# Altium schematic sheet Atom.SchDoc
size A2
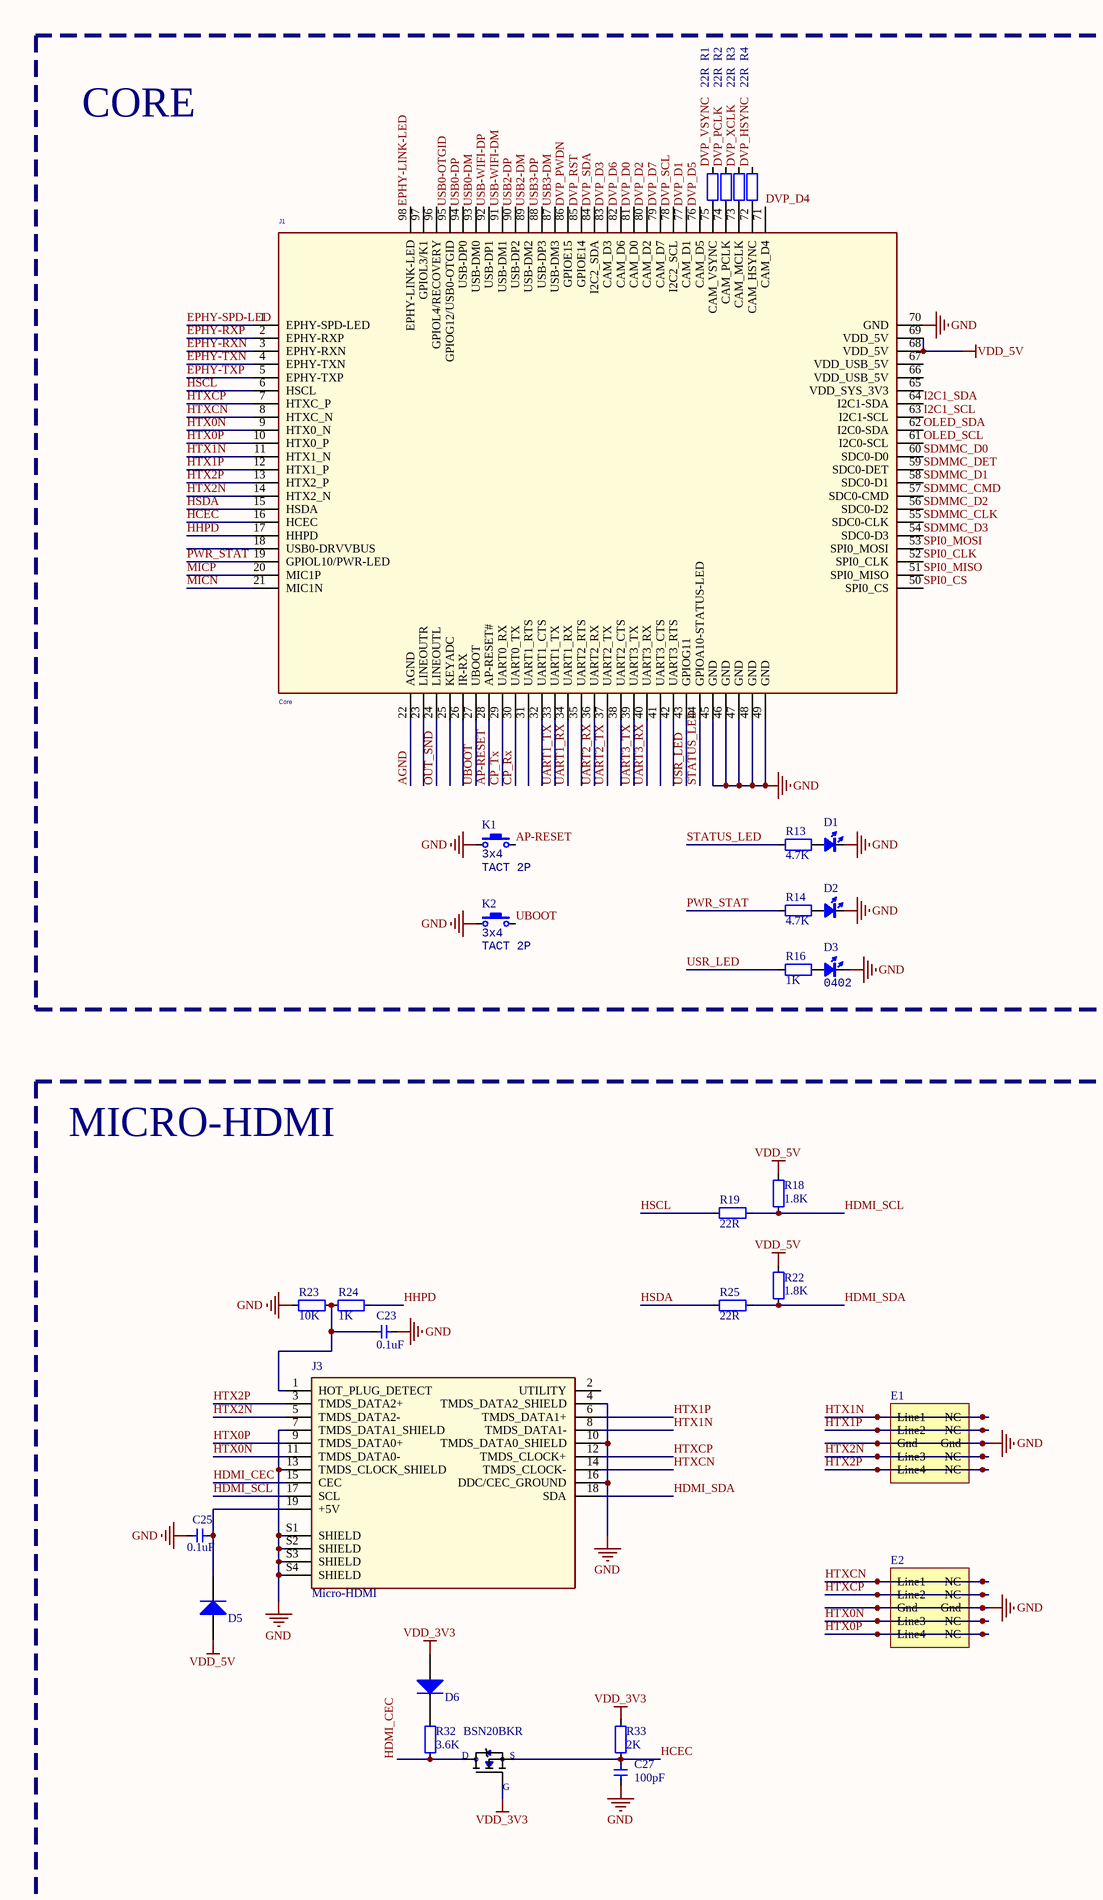
[diagram p0: Atom.SchDoc, left]
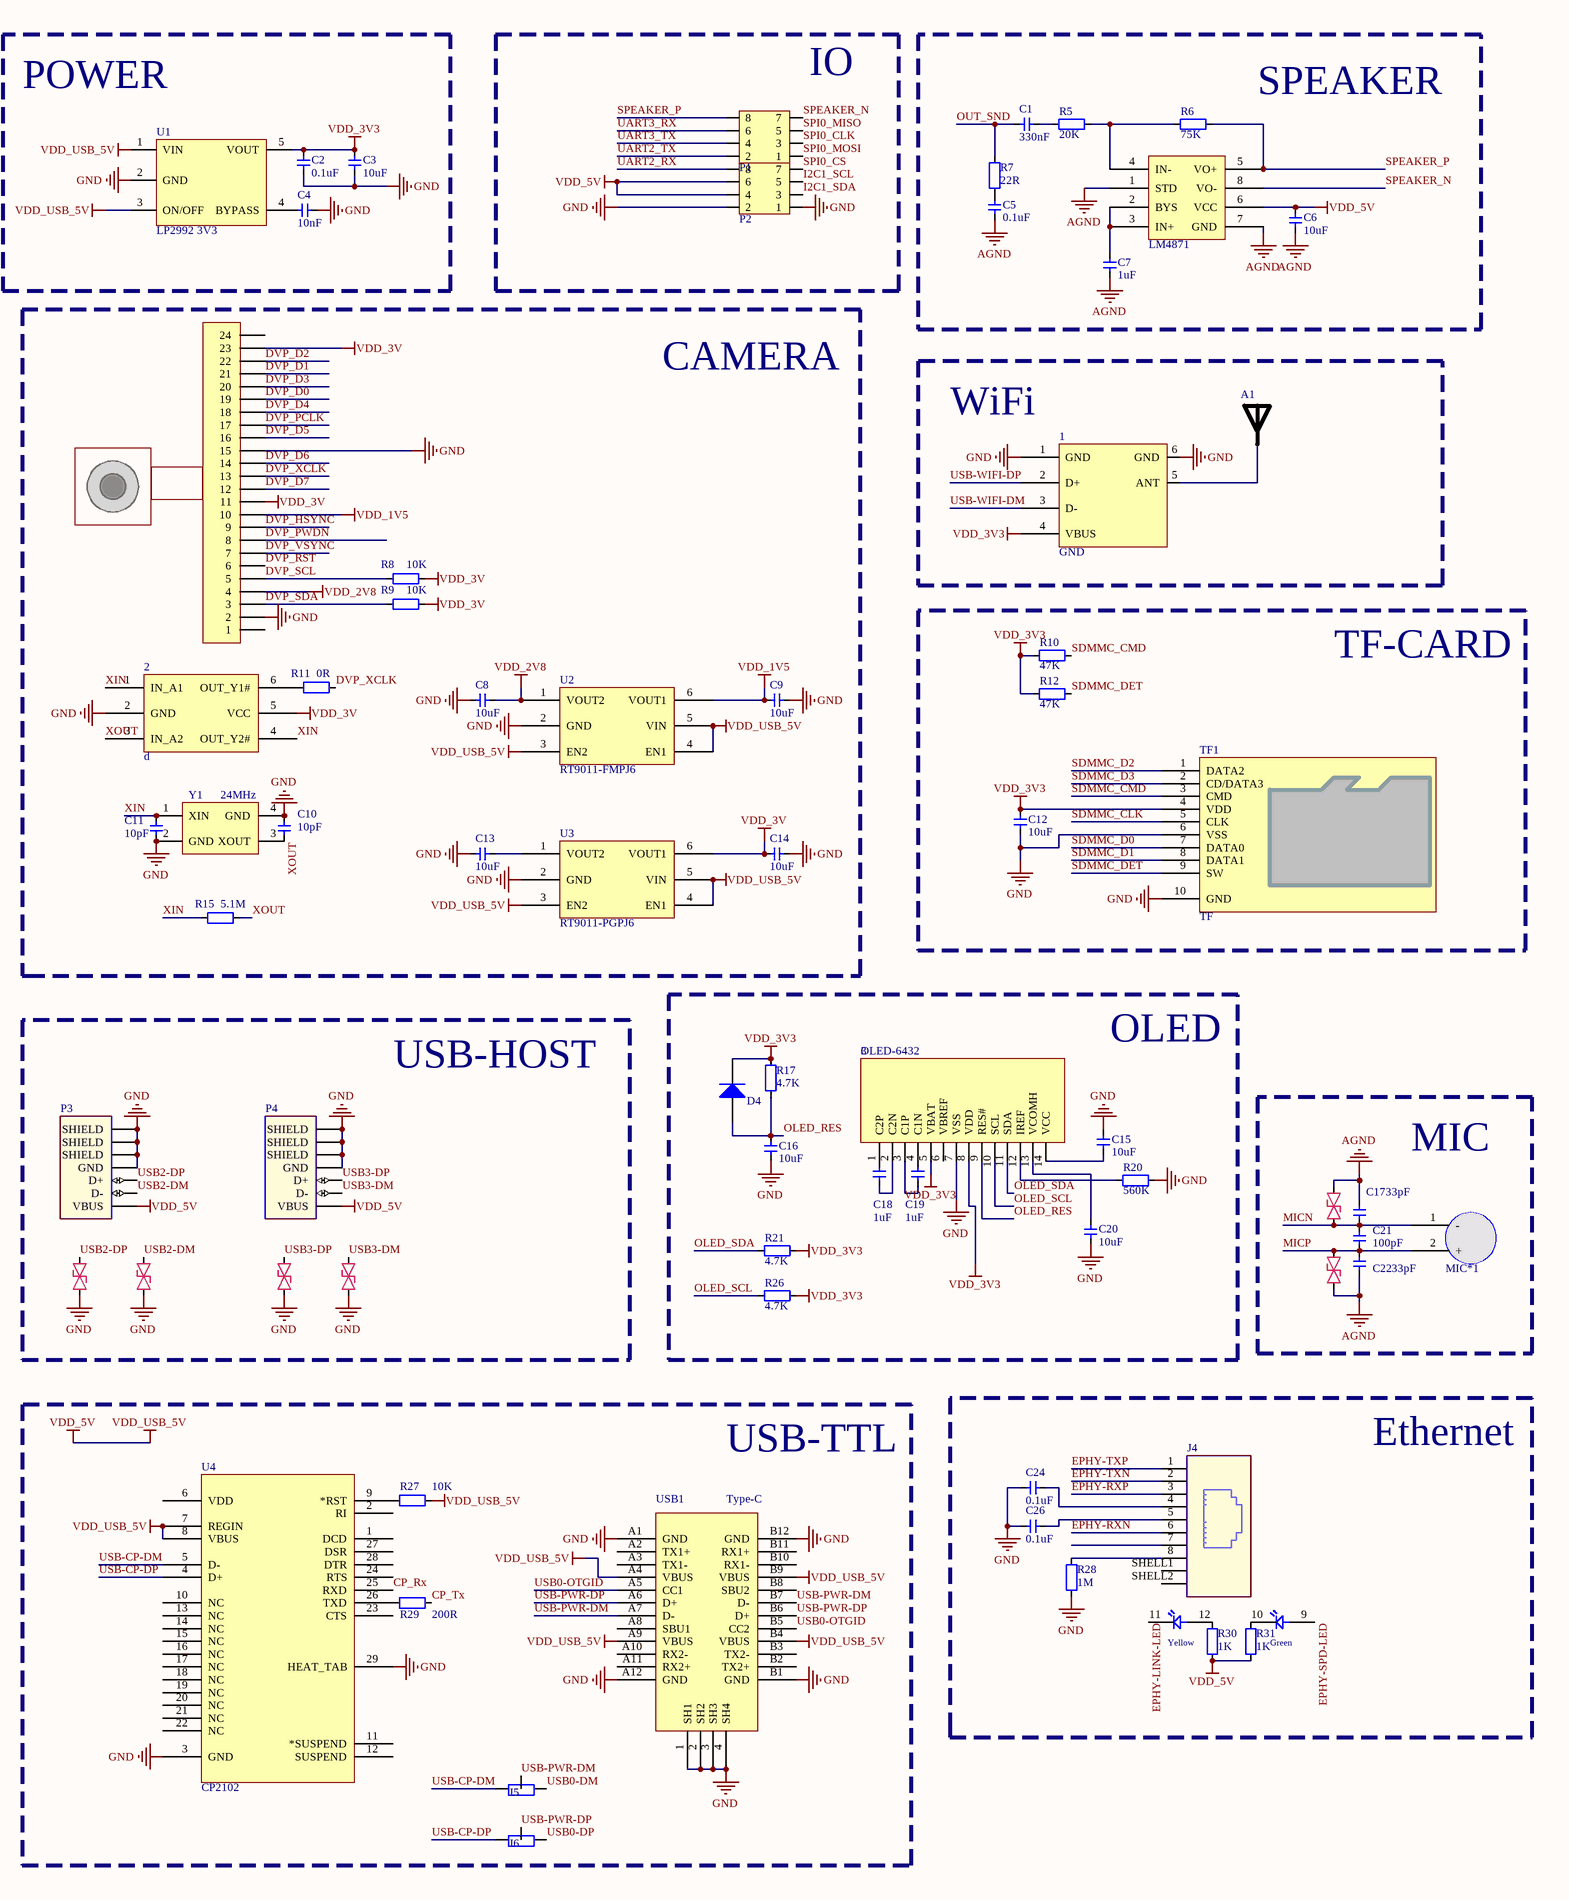
[diagram p1: Atom.SchDoc, right]

## Parts
1  GND  [USB-WiFI-ANT]
2  d  [SOT363-6]
3  OLED-6432  [OLED-6432-TOP]
4  BSN20BKR  [SOT23-3]
*1  LM4871  [MSOP-8]
A1  RAINSUN  [ANT-Rainsun-AN5120]  (value not drawn)
C1  330nF  [0603-CAP]
C2  0.1uF  [CAP_0402]
C3  10uF  [CAP_0402]
C4  10nF  [CAP_0402]
C5  0.1uF  [CAP_0402]
C6  10uF  [CAP_0402]
C7  1uF  [CAP_0402]
C8  10uF  [CAP_0402]
C9  10uF  [CAP_0402]
C10  10pF  [CAP_0402]
C11  10pF  [CAP_0402]
C12  10uF  [CAP_0402]
C13  10uF  [CAP_0402]
C14  10uF  [CAP_0402]
C15  10uF  [CAP_0402]
C16  10uF  [CAP_0402]
C17  33pF  [CAP_0402]
C18  1uF  [CAP_0402]
C19  1uF  [CAP_0402]
C20  10uF  [CAP_0402]
C21  100pF  [CAP_0402]
C22  33pF  [CAP_0402]
C23  0.1uF  [CAP_0402]
C24  0.1uF  [CAP_0402]
C25  0.1uF  [CAP_0402]
C26  0.1uF  [CAP_0402]
C27  100pF  [CAP_0402]
D1  color?  [LED_0402_RED]  (value not drawn)
D2  color?  [LED_0402_RED]  (value not drawn)
D3  Type: 0402  [LED_0402_RED]  (hidden comment: color?)
D4  二极管-5B5817WS  [SOD-323]  (value not drawn)
D5  二极管-5B5817WS  [SOD-323]  (value not drawn)
D6  二极管-5B5817WS  [SOD-323]  (value not drawn)
E1  E?  [DFN-2510]  (value not drawn)
E2  E?  [DFN-2510]  (value not drawn)
ESD-1  ESD-0402  [ESD-0402]  (value not drawn)
ESD-2  ESD-0402  [ESD-0402]  (value not drawn)
ESD-3  ESD-0402  [ESD-0402]  (value not drawn)
ESD-4  ESD-0402  [ESD-0402]  (value not drawn)
ESD-5  ESD-0402  [ESD-0402]  (value not drawn)
ESD-6  ESD-0402  [ESD-0402]  (value not drawn)
J1  Core  [Quantum-Quark]
J2  0.5S_A_24PWB  [FPC-24P]  (value not drawn)
J3  Micro-HDMI  [MICRO HDMI]
J4  RJ45座  [RJ45母座]  (value not drawn)
J5  选择跳线  [jumper-3]  (value not drawn)
J6  选择跳线  [jumper-3]  (value not drawn)
K1  value 3x4  [ButtonTACT_3x4x2_180]  (hidden comment: TACT 2P)
K2  value 3x4  [ButtonTACT_3x4x2_180]  (hidden comment: TACT 2P)
MIC*1  MIC*  [MIC-0416]  (value not drawn)
P1  HDR2x4_2.54  [HDR2X4_2.0_180H]  (value not drawn)
P2  HDR2x4_2.54  [HDR2X4_2.0_180H]  (value not drawn)
P3  USB-侧立式  [USB-侧立式]  (value not drawn)
P4  USB-侧立式  [USB-侧立式]  (value not drawn)
R1  22R  [RES_0402]
R2  22R  [RES_0402]
R3  22R  [RES_0402]
R4  22R  [RES_0402]
R5  20K  [RES_0402]
R6  75K  [RES_0402]
R7  22R  [RES_0402]
R8  10K  [RES_0402]
R9  10K  [RES_0402]
R10  47K  [RES_0402]
R11  0R  [RES_0402]
R12  47K  [RES_0402]
R13  4.7K  [RES_0402]
R14  4.7K  [RES_0402]
R15  5.1M  [RES_0402]
R16  1K  [RES_0402]
R17  4.7K  [RES_0402]
R18  1.8K  [RES_0402]
R19  22R  [RES_0402]
R20  560K  [RES_0402]
R21  4.7K  [RES_0402]
R22  1.8K  [RES_0402]
R23  10K  [RES_0402]
R24  1K  [RES_0402]
R25  22R  [RES_0402]
R26  4.7K  [RES_0402]
R27  10K  [RES_0402]
R28  1M  [RES_0402]
R29  200R  [RES_0402]
R30  1K  [RES_0402]
R31  1K  [RES_0402]
R32  3.6K  [RES_0402]
R33  2K  [RES_0402]
TF1  TF  [TF-SOCKET - short]
U1  LP2992 3V3  [SOT23-5]
U2  RT9011-FMPJ6  [SOT23-6]
U3  RT9011-PGPJ6  [SOT23-6]
U4  CP2102  [QFN-28]
USB1  Type-C  [Type-C-TOP]
Y1  24MHz  [晶振2520]

## Blocks framed on the sheet
POWER: C2-C4 U1
IO: P1 P2
SPEAKER: *1 C1 C5-C7 R5-R7
TF-CARD: C12 R10 R12 TF1
USB-HOST: ESD-3-ESD-6 P3 P4

## Nets
AGND: *1.1(STD) *1.7(GND) C5.1 C6.1 C7.1 C17.1 C22.1 ESD-1.2 ESD-2.1 J1.22(AGND)
GND: 1.1(GND) 1.6(GND) 2.2(GND) 3.7(VSS) C2.1 C3.1 C4.1 C8.1 C9.1 C10.2 C11.1 C12.1 C13.1 C14.1 C15.1 C16.1 C20.2 C23.1 C24.2 C25.2 C26.2 C27.1 D1.2(K) D2.2(K) D3.2(K) E1.3(Gnd) E1.8(Gnd) E2.3(Gnd) E2.8(Gnd) ESD-3.1 ESD-4.1 ESD-5.1 ESD-6.1 J1.45(GND) J1.46(GND) J1.47(GND) J1.48(GND) J1.49(GND) J1.70(GND) J2.2 J2.15 J3.4(TMDS_DATA2_SHIELD) J3.7(TMDS_DATA1_SHIELD) J3.10(TMDS_DATA0_SHIELD) J3.13(TMDS_CLOCK_SHIELD) J3.16(DDC/CEC_GROUND) J3.S1(SHIELD) J3.S2(SHIELD) J3.S3(SHIELD) J3.S4(SHIELD) K1.1 K2.1 P2.1 P2.2 P3.4(GND) P3.5(SHIELD) P3.6(SHIELD) P3.7(SHIELD) P4.4(GND) P4.5(SHIELD) P4.6(SHIELD) P4.7(SHIELD) R20.1 R23.1 R28.1 TF1.6(VSS) TF1.10(GND) U1.2(GND) U2.2(GND) U3.2(GND) U4.3(GND) U4.29(HEAT_TAB) USB1.1(SH1) USB1.2(SH2) USB1.3(SH3) USB1.4(SH4) USB1.A1(GND) USB1.A12(GND) USB1.B1(GND) USB1.B12(GND) Y1.2(GND) Y1.4(GND)
VDD_1V5: C9.2 J2.10 U2.6(VOUT1)
VDD_2V8: C8.2 J2.4 U2.1(VOUT2)
VDD_3V: 2.5(VCC) C14.2 J2.11 J2.23 R8.2 R9.2 U3.6(VOUT1)
VDD_3V3: 1.4(VBUS) 3.5(VBAT) 3.8(VDD) 4.1(G) C2.2 C3.2 C12.2 D4.2(K) D6.1(A) R10.1 R12.1 R17.1 R21.2 R26.2 R33.2 TF1.4(VDD) U1.5(VOUT)
VDD_5V: *1.6(VCC) C6.2 D5.1(A) J1.68(VDD_5V) J1.69(VDD_5V) P2.4 P2.6 P3.1(VBUS) P4.1(VBUS) R18.2 R22.2 R27.1 R30.1 R31.1 U1.1(VIN) U1.3(ON/OFF) U2.3(EN2) U2.4(EN1) U2.5(VIN) U3.3(EN2) U3.4(EN1) U3.5(VIN) U4.7(REGIN) U4.8(VBUS) USB1.A4(VBUS) USB1.A9(VBUS) USB1.B4(VBUS) USB1.B9(VBUS)  [also labelled VDD_USB_5V]
AP-RESET: J1.28(AP-RESET#) K1.2
CP_Rx: J1.30(UART0_TX) U4.25(RXD)
CP_Tx: J1.29(UART0_RX) R29.1
DVP_D0: J1.81(CAM_D0) J2.19
DVP_D1: J1.77(CAM_D1) J2.21
DVP_D2: J1.80(CAM_D2) J2.22
DVP_D3: J1.83(CAM_D3) J2.20
DVP_D4: J1.71(CAM_D4) J2.18
DVP_D5: J1.76(CAM_D5) J2.16
DVP_D6: J1.82(CAM_D6) J2.14
DVP_D7: J1.79(CAM_D7) J2.12
DVP_HSYNC: J2.9 R4.1
DVP_PCLK: J2.17 R2.1
DVP_PWDN: J1.86(GPIOE15) J2.8
DVP_RST: J1.85(GPIOE14) J2.6
DVP_SCL: J1.78(I2C2_SCL) J2.5 R8.1
DVP_SDA: J1.84(I2C2_SDA) J2.3 R9.1
DVP_VSYNC: J2.7 R1.1
DVP_XCLK: J2.13 R3.1 R11.2
EPHY-LINK-LED: J1.98(EPHY-LINK-LED) J4.11
EPHY-RXN: J1.3(EPHY-RXN) J4.6
EPHY-RXP: J1.2(EPHY-RXP) J4.3
EPHY-SPD-LED: J1.1(EPHY-SPD-LED) J4.9
EPHY-TXN: J1.4(EPHY-TXN) J4.2
EPHY-TXP: J1.5(EPHY-TXP) J4.1
HCEC: 4.2(S) C27.2 J1.16(HCEC) R33.1
HDMI_CEC: 4.3(D) J3.15(CEC) R32.1
HDMI_SCL: J3.17(SCL) R18.1 R19.2
HDMI_SDA: J3.18(SDA) R22.1 R25.2
HHPD: J1.17(HHPD) R24.2
HSCL: J1.6(HSCL) R19.1
HSDA: J1.15(HSDA) R25.1
HTX0N: E2.4(Line3) E2.7(NC) J1.9(HTX0_N) J3.11(TMDS_DATA0-)
HTX0P: E2.5(Line4) E2.6(NC) J1.10(HTX0_P) J3.9(TMDS_DATA0+)
HTX1N: E1.1(Line1) E1.10(NC) J1.11(HTX1_N) J3.8(TMDS_DATA1-)
HTX1P: E1.2(Line2) E1.9(NC) J1.12(HTX1_P) J3.6(TMDS_DATA1+)
HTX2N: E1.4(Line3) E1.7(NC) J1.14(HTX2_N) J3.5(TMDS_DATA2-)
HTX2P: E1.5(Line4) E1.6(NC) J1.13(HTX2_P) J3.3(TMDS_DATA2+)
HTXCN: E2.1(Line1) E2.10(NC) J1.8(HTXC_N) J3.14(TMDS_CLOCK-)
HTXCP: E2.2(Line2) E2.9(NC) J1.7(HTXC_P) J3.12(TMDS_CLOCK+)
I2C1_SCL: J1.63(I2C1-SCL) P2.5
I2C1_SDA: J1.64(I2C1-SDA) P2.3
MICN: C17.2 C21.2 ESD-1.1 J1.21(MIC1N) MIC*1.1(-)
MICP: C21.1 C22.2 ESD-2.2 J1.20(MIC1P) MIC*1.2(+)
OLED_RES: 3.9(RES#) C16.2 D4.1(A) R17.2
OLED_SCL: 3.10(SCL) J1.61(I2C0-SCL) R26.1
OLED_SDA: 3.11(SDA) J1.62(I2C0-SDA) R21.1
OUT_SND: C1.2 J1.24(LINEOUTL) R7.2
PWR_STAT: J1.19(GPIOL10/PWR-LED) R14.1
SDMMC_CLK: J1.55(SDC0-CLK) TF1.5(CLK)
SDMMC_CMD: J1.57(SDC0-CMD) R10.2 TF1.3(CMD)
SDMMC_D0: J1.60(SDC0-D0) TF1.7(DATA0)
SDMMC_D1: J1.58(SDC0-D1) TF1.8(DATA1)
SDMMC_D2: J1.56(SDC0-D2) TF1.1(DATA2)
SDMMC_D3: J1.54(SDC0-D3) TF1.2(CD/DATA3)
SDMMC_DET: J1.59(SDC0-DET) R12.2 TF1.9(SW)
SPEAKER_N: *1.8(VO-) P1.7
SPEAKER_P: *1.5(VO+) P1.8 R6.2
SPI0_CLK: J1.52(SPI0_CLK) P1.3
SPI0_CS: J1.50(SPI0_CS) P2.7
SPI0_MISO: J1.51(SPI0_MISO) P1.5
SPI0_MOSI: J1.53(SPI0_MOSI) P1.1
STATUS_LED: J1.44(GPIOA10-STATUS-LED) R13.1
UART1_RX: J1.34(UART1_RX)
UART1_TX: J1.33(UART1_TX)
UART2_RX: J1.36(UART2_RX) P2.8
UART2_TX: J1.37(UART2_TX) P1.2
UART3_RX: J1.40(UART3_RX) P1.6
UART3_TX: J1.39(UART3_TX) P1.4
UBOOT: J1.27(UBOOT) K2.2
USB0-DM: J1.93(USB-DM0) J5.3
USB0-DP: J1.94(USB-DP0) J6.3
USB0-OTGID: J1.95(GPIOG12/USB0-OTGID) USB1.A5(CC1) USB1.B5(CC2)
USB2-DM: ESD-4.2 J1.89(USB-DM2) P3.2(D-)
USB2-DP: ESD-3.2 J1.90(USB-DP2) P3.3(D+)
USB3-DM: ESD-6.2 J1.87(USB-DM3) P4.2(D-)
USB3-DP: ESD-5.2 J1.88(USB-DP3) P4.3(D+)
USB-CP-DM: J5.1 U4.5(D-)
USB-CP-DP: J6.1 U4.4(D+)
USB-PWR-DM: J5.2 USB1.A7(D-) USB1.B7(D-)
USB-PWR-DP: J6.2 USB1.A6(D+) USB1.B6(D+)
USB-WIFI-DM: 1.3(D-) J1.91(USB-DM1)
USB-WIFI-DP: 1.2(D+) J1.92(USB-DP1)
USR_LED: J1.43(GPIOG11) R16.1
XIN: 2.1(IN_A1) 2.4(OUT_Y2#) C11.2 R15.1 Y1.1(XIN)
XOUT: 2.3(IN_A2) C10.1 R15.2 Y1.3(XOUT)
Net1_5: 1.5(ANT) A1.1
Net2_6: 2.6(OUT_Y1#) R11.1
Net3_1: 3.1(C2P) C18.2
Net3_2: 3.2(C2N) C18.1
Net3_3: 3.3(C1P) C19.1
Net3_4: 3.4(C1N) C19.2
Net3_12: 3.12(IREF) R20.2
Net3_13: 3.13(VCOMH) C20.1
Net3_14: 3.14(VCC) C15.2
Net*1_2: *1.2(BYS) *1.3(IN+) C7.2
Net*1_4: *1.4(IN-) R5.2 R6.1
NetC1_1: C1.1 R5.1
NetC4_2: C4.2 U1.4(BYPASS)
NetC5_2: C5.2 R7.1
NetC13_2: C13.2 U3.1(VOUT2)
NetC23_2: C23.2 J3.1(HOT_PLUG_DETECT) R23.2 R24.1
NetC24_1: C24.1 J4.4
NetC25_1: C25.1 D5.2(K) J3.19(+5V)
NetC26_1: C26.1 J4.5
NetD1_1: D1.1(A) R13.2
NetD2_1: D2.1(A) R14.2
NetD3_1: D3.1(A) R16.2
NetD6_2: D6.2(K) R32.2
NetJ1_72: J1.72(CAM_HSYNC) R4.2
NetJ1_73: J1.73(CAM_MCLK) R3.2
NetJ1_74: J1.74(CAM_PCLK) R2.2
NetJ1_75: J1.75(CAM_VSYNC) R1.2
NetJ4_8: J4.8 R28.2
NetJ4_10: J4.10 R31.2
NetJ4_12: J4.12 R30.2
NetR27_2: R27.2 U4.9(*RST)
NetR29_2: R29.2 U4.26(TXD)

Not connected (* = marked no-connect by the designer): 3 6(VBREF); J1 18(USB0-DRVVBUS) 23(LINEOUTR) 25(KEYADC) 26(IR-RX) 31(UART1_RTS) 32(UART1_CTS) 35(UART2_RTS) 38(UART2_CTS) 41(UART3_CTS) 42(UART3_RTS) 65(VDD_SYS_3V3) 66(VDD_USB_5V) 67(VDD_USB_5V) 96(GPIOL4/RECOVERY) 97(GPIOL3/K1); J2 1 24; J3 2(UTILITY); J4 7(2) SHELL1(SHIELD) SHELL2(SHIELD); U4 1(DCD) 2(RI) 6(VDD) 10(NC) 11(*SUSPEND) 12(SUSPEND) 13(NC) 14(NC) 15(NC) 16(NC) 17(NC) 18(NC) 19(NC) 20(NC) 21(NC) 22(NC) 23(CTS) 24(RTS) 27(DSR) 28(DTR); USB1 A2(TX1+) A3(TX1-) A8(SBU1) A10(RX2-) A11(RX2+) B2(TX2+) B3(TX2-) B8(SBU2) B10(RX1-) B11(RX1+)

## Notes on the sheet
- CORE
- CAMERA
- (near 1) WiFi
- OLED
- MICRO-HDMI
- MIC
- USB-TTL
- Ethernet
- (in symbol RJ45座) Yellow; Green

## Library data of the parts
1 = USB-WiFi-ANT
2 = NL27WZU04DF
3 = OLED-6432: 显示屏
4 = BSN20BKR: N-Channel 60 V 2.8 Ohm 310 mW 0.49 nC Surface Mount Trench MosFet - SOT-23; MF: Nexperia USA; Price: None; SnapEDA_Link: https://www.snapeda.com/parts/BSN20BKR/Nexperia%20USA%20Inc./view-part/?ref=snap; Availability: Unavailable; MP: BSN20BKR; Package: SOT-23 Nexperia; Value: *
A1 = ANT-Rainsun-AP5120
C1 = 电容-0603: Capacitor; Value: 0.1u
C2-C27 = 电容-0402: Capacitor; Value: 0.1u
D1 D2 = LED_0402: LED; Type: 0402; Value: color?
D3 = LED_0402: LED; Value: color?
D4-D6 = 二极管-5B5817WS: 40V
E1 E2 = AZ1045-04F
ESD-1-ESD-6 = ESD-0402: ESD
J1 = Quantum-Quark-Core
J2 = OV2640: Header, 24-Pin; LatestRevisionDate: 17-Jul-2002; LatestRevisionNote: Re-released for DXP Platform.; Publisher: Altium Limited
J3 = Micro-HDMI: Conn Micro HDMI RCP 19 POS 0.4mm Solder RA SMD 19 Terminal 1 Port Micro HDMI Embossed T/R; MF: Molex; MP: 0467650301; Package: None; Availability: Unavailable; SnapEDA_Link: https://www.snapeda.com/parts/0467650301/Molex/view-part/?ref=snap; Price: None; Value: *
J4 = RJ45座: MF: Wurth; MP: 615008137421; Package: None; Price: 2.50 USD; Availability: Good; SnapEDA_Link: https://www.snapeda.com/parts/615008137421/Wurth%20Electronics%20Inc/view-part/?ref=snap; Value: *
J5 J6 = 选择跳线: Resistor; Published: 8-Jun-2000; LatestRevisionDate: 17-Jul-2002; LatestRevisionNote: Re-released for DXP Platform.; PackageReference: AXIAL-0.4; Publisher: Altium Limited; PackageDescription: Axial Device, Thru-Hole; 2 Leads; 0.4 in Pin Spacing
K1 K2 = ButtonTACT_3x4x2_180: Button; type: TACT 2P
MIC*1 = MIC
P1 P2 = HDR2x4_2.54: Header
P3 P4 = USB-侧立式: USB A Skt, Upright/Flag, R/A GF, W/kinked shell stake, tray; MF: Global Connector Technology; MP: USB1025-GF-P-B; Availability: Unavailable; Price: None; SnapEDA_Link: https://www.snapeda.com/parts/USB1025-GF-P-B/Global%20Connector%20Technology/view-part/?ref=snap; Package: None; Value: *
R1-R4 R7 R19 R25 = 电阻-0402: Resistor; Value: 22R
R5 R6 R8-R18 R20-R24 R26-R33 = 电阻-0402: Resistor; Value: 22R
TF1 = TF卡座: 8脚自弹
U1 = LP2992: LDO
U2 U3 = RT9011
U4 = CP2102: USB转TTL; PART DESC: SINGLE-CHIP USB TO UART BRIDGE, QFN28, RoHS.; MFG #1: SILICON LABS; PART NUMBER: CP2102; Value: Value; RefDes: RefDes; Type: DEV
USB1 = USB-Type-C-TOP
Y1 = 晶振-4Pin-无源: 2520无源; MF: ECS International; MP: ECS-3225S30-240-EN-TR; Package: SMD-6 ECS International; Price: 0.75 USD; Availability: Unavailable; Value: *